# EAGLE schematic Schematic (EAGLE 6.5.0)
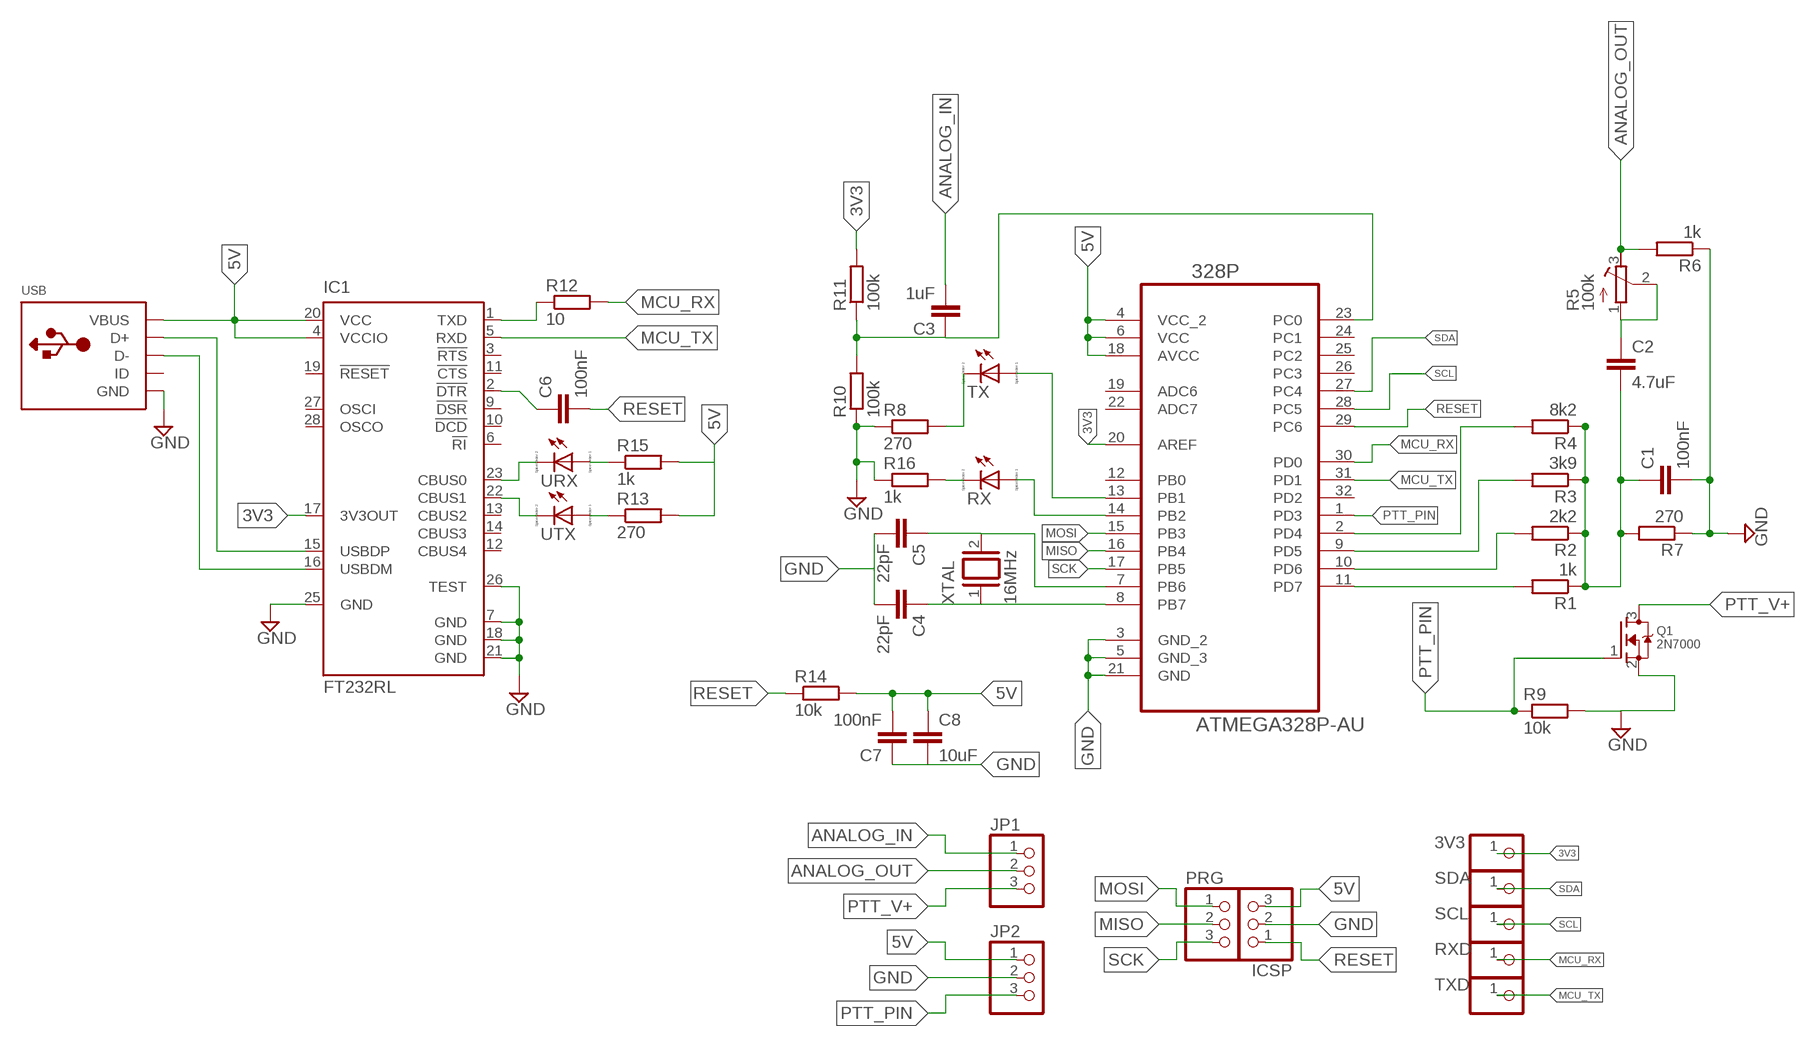
[diagram p0: schematic, sheet 1]

## Parts
3V3  PINHD-1X1  [1X01]
328P  ATMEGA328P-AU  [QFP80P900X900X120-32N]
C1  100nF  C-EUC0603  [C0603]
C2  4.7uF  C-EUC0805  [C0805]
C3  1uF  C-EUC0603  [C0603]
C4  22pF  C-EUC0603  [C0603]
C5  22pF  C-EUC0603  [C0603]
C6  100nF  C-EUC0603  [C0603]
C7  100nF  C-EUC0603  [C0603]
C8  10uF  C-EUC0805  [C0805]
IC1  FT232RL  [SSOP28]
ICSP  PINHD-1X3  [1X03]
JP1  PINHD-1X3  [1X03]
JP2  PINHD-1X3  [1X03]
PRG  PINHD-1X3  [1X03]
Q1  2N7000  MOSFET-NREFLOW  [SOT23]
R1  1k  R-EU_R0603  [R0603]
R2  2k2  R-EU_R0603  [R0603]
R3  3k9  R-EU_R0603  [R0603]
R4  8k2  R-EU_R0603  [R0603]
R5  100k  R-TRIMM3339P  [RTRIM3339P]
R6  1k  R-EU_R0603  [R0603]
R7  270  R-EU_R0603  [R0603]
R8  270  R-EU_R0603  [R0603]
R9  10k  R-EU_R0603  [R0603]
R10  100k  R-EU_R0603  [R0603]
R11  100k  R-EU_R0603  [R0603]
R12  10  R-EU_R0603  [R0603]
R13  270  R-EU_R0603  [R0603]
R14  10k  R-EU_R0603  [R0603]
R15  1k  R-EU_R0603  [R0603]
R16  1k  R-EU_R0603  [R0603]
RX  LED_ESML0603  [LED_SML0603]
RXD  PINHD-1X1  [1X01]
SCL  PINHD-1X1  [1X01]
SDA  PINHD-1X1  [1X01]
TX  LED_ESML0603  [LED_SML0603]
TXD  PINHD-1X1  [1X01]
URX  LED_ESML0603  [LED_SML0603]
USB  USBMOLEX  [USB-MINIB-THM-MOLEX]
UTX  LED_ESML0603  [LED_SML0603]
XTAL  16MHz  XTAL/S  [QS]

## Nets
3V3: 3V3.1 328P.20(AREF) IC1.17(3V3OUT) R11.2
5V: 328P.4(VCC_2) 328P.6(VCC) 328P.18(AVCC) C7.2 C8.1 IC1.4(VCCIO) IC1.20(VCC) ICSP.3 JP2.1 R13.2 R14.2 R15.2 USB.VBUS
ADC0: 328P.23(PC0) C3.1 R10.2 R11.1
ANALOG_IN: C3.2 JP1.1
ANALOG_OUT: JP1.2 R5.3(E) R6.2
DAC_1: 328P.2(PD4) R4.2
DAC_2: 328P.9(PD5) R3.2
DAC_3: 328P.10(PD6) R2.2
DAC_4: 328P.11(PD7) R1.2
DTR: C6.1 IC1.2(!DTR)
FTDI_TX: IC1.1(TXD) R12.1
GND: 328P.3(GND_2) 328P.5(GND_3) 328P.21(GND) C1.2 C4.2 C5.2 C7.1 C8.2 IC1.7(GND) IC1.18(GND) IC1.21(GND) IC1.25(GND) IC1.26(TEST) ICSP.2 JP2.2 Q1.2(S) R6.1 R7.1 R8.1 R9.2 R10.1 R16.1 USB.GND
MCU_RX: 328P.30(PD0) R12.2 RXD.1
MCU_TX: 328P.31(PD1) IC1.5(RXD) TXD.1
MISO: 328P.16(PB4) PRG.2
MOSI: 328P.15(PB3) PRG.1
N$1: R13.1 UTX.A
N$2: IC1.23(CBUS0) URX.C
N$3: IC1.22(CBUS1) UTX.C
N$4: R15.1 URX.A
N$5: 328P.7(PB6) C5.1 XTAL.2
N$6: C1.1 C2.2 R1.1 R2.1 R3.1 R4.1 R7.2
N$7: R16.2 RX.C
N$8: 328P.14(PB2) RX.A
N$9: C2.1 R5.1(A) R5.2(S)
N$10: 328P.13(PB1) TX.A
N$12: 328P.8(PB7) C4.1 XTAL.1
N$13: R8.2 TX.C
N$14: IC1.15(USBDP) USB.D+
N$15: IC1.16(USBDM) USB.D-
PTT_PIN: 328P.1(PD3) JP2.3 Q1.1(G) R9.1
PTT_V+: JP1.3 Q1.3(D)
RESET: 328P.29(PC6) C6.2 ICSP.1 R14.1
SCK: 328P.17(PB5) PRG.3
SCL: 328P.28(PC5) SCL.1
SDA: 328P.27(PC4) SDA.1
Unconnected: 328P.12(PB0) 328P.19(ADC6) 328P.22(ADC7) 328P.24(PC1) 328P.25(PC2) 328P.26(PC3) 328P.32(PD2) IC1.3(!RTS) IC1.6(!RI) IC1.9(!DSR) IC1.10(!DCD) IC1.11(!CTS) IC1.12(CBUS4) IC1.13(CBUS2) IC1.14(CBUS3) IC1.19(!RESET) IC1.27(OSCI) IC1.28(OSCO) USB.ID

## Library data of the parts
3V3 RXD SCL SDA TXD = adafruit:PINHD-1X1: Pin header 1x1 for 0.1" spacing With round pins
328P = Atmel_By_element14_Batch_1-00:ATMEGA328P-AU: 8-bit Microcontroller with In-System Programmable Flash; MPN: ATMEGA328P-AU; OC_FARNELL: 1715486; OC_NEWARK: 14R4631; PACKAGE: TQFP-32; SUPPLIER: Atmel
C1-C8 = rcl:C-EU: CAPACITOR, European symbol
IC1 = ftdichip:FT232R: Source: http://www.ftdichip.com/Documents/DataSheets/DS_FT232R_v104.pdf; MPN: FT232RL; OC_FARNELL: 1146032; OC_NEWARK: 91K9918
ICSP JP1 JP2 PRG = adafruit-edited:PINHD-1X3: PIN HEADER
Q1 = adafruit-edited:MOSFET-N: N-Channel Mosfet 2N7002E - 60V 260mA SOT23 [Digikey: 2N7002ET1GOSTR-ND] - REEL BSH103 - 30V 850mA SOT23 [Digikey: 568-5013-1-ND]
R1-R4 R6-R16 = rcl:R-EU_: RESISTOR, European symbol
R5 = rcl:R-TRIMM: Trimm resistor
RX TX URX UTX = eagle-ltspice:LED_E: LED Source: http://www.osram.convergy.de Source: www.luxeon.com Source: www.kingbright.com; SPICEMODEL: NONE; SPICEPREFIX: D; SPICETYPE: diode
USB = adafruit:USB: USB Connectors USBMINIB - Surface Mount Female Mini-B USB Connector 4UConnector: 06564 By microbuilder.eu Thru-hole RA Female Mini-B USB Connector 4UConnector: 18732 By ladyada.net
XTAL = special:XTAL/S: CRYSTAL